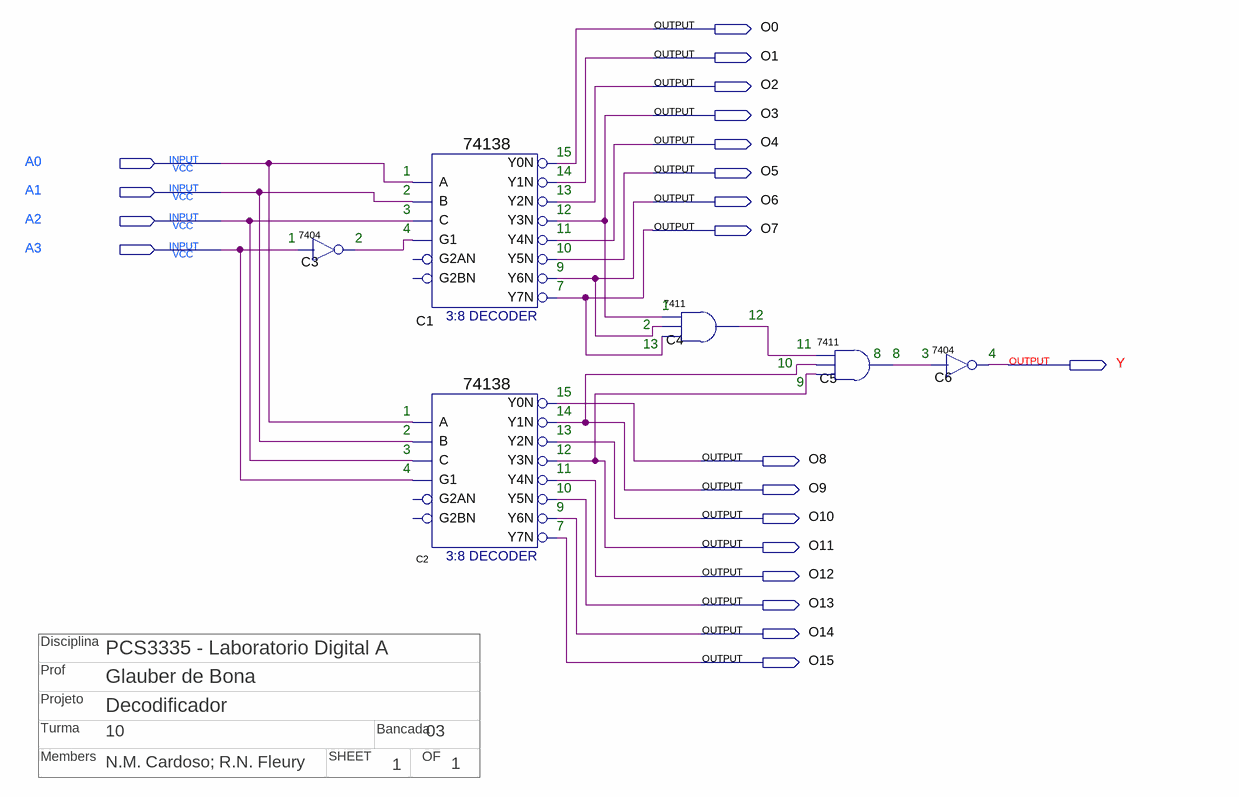
[diagram p0: schematic sheet]
// Quartus schematic exp03_1.bdf as structural Verilog: 6 symbols, 21 pins
// Title block: Bancada: 03; Disciplina: PCS3335 - Laboratorio Digital A; Members: N.M. Cardoso; R.N. Fleury; OF: 1; Prof: Glauber de Bona; Projeto: Decodificador; SHEET: 1; Turma: 10
module exp03_1 (
  input  A0,
  input  A1,
  input  A2,
  input  A3,
  output O0,
  output O1,
  output O2,
  output O3,
  output O4,
  output O5,
  output O6,
  output O7,
  output Y,
  output O8,
  output O9,
  output O10,
  output O11,
  output O12,
  output O13,
  output O14,
  output O15
);

  wire C3_1, C4_1, C5_1;

  \7404  C3 (.\2 (A3), .\1 (C3_1));
  \74138  C1 (
    .A(A0), .B(A1), .G1(C3_1), .C(A2), .Y0N(O0), .Y1N(O1), .Y2N(O2), .Y3N(O3), .Y4N(O4), .Y5N(O5), .Y6N(O6),
    .Y7N(O7));  // open: G2AN, G2BN
  \74138  C2 (
    .A(A0), .B(A1), .G1(A3), .C(A2), .Y0N(O8), .Y1N(O9), .Y2N(O10), .Y3N(O11), .Y4N(O12), .Y5N(O13),
    .Y6N(O14), .Y7N(O15));  // open: G2AN, G2BN
  \7411  C4 (.\2 (O3), .\3 (O6), .\4 (O7), .\1 (C4_1));
  \7411  C5 (.\2 (C4_1), .\3 (O9), .\4 (O11), .\1 (C5_1));
  \7404  C6 (.\2 (C5_1), .\1 (Y));

  // Notes on the sheet:
  //   15
  //   1
  //   14
  //   2
  //   13
  //   3
  //   12
  //   4
  //   11
  //   1
  //   2
  //   10
  //   9
  //   7
  //   1
  //   12
  //   2
  //   13
  //   11
  //   8
  //   8
  //   3
  //   4
  //   10
  //   9
  //   15
  //   1
  //   14
  //   2
  //   13
  //   3
  //   12
  //   4
  //   11
  //   10
  //   9
  //   7
endmodule
